# EAGLE design Tact_Switch (EAGLE 7.6.0)
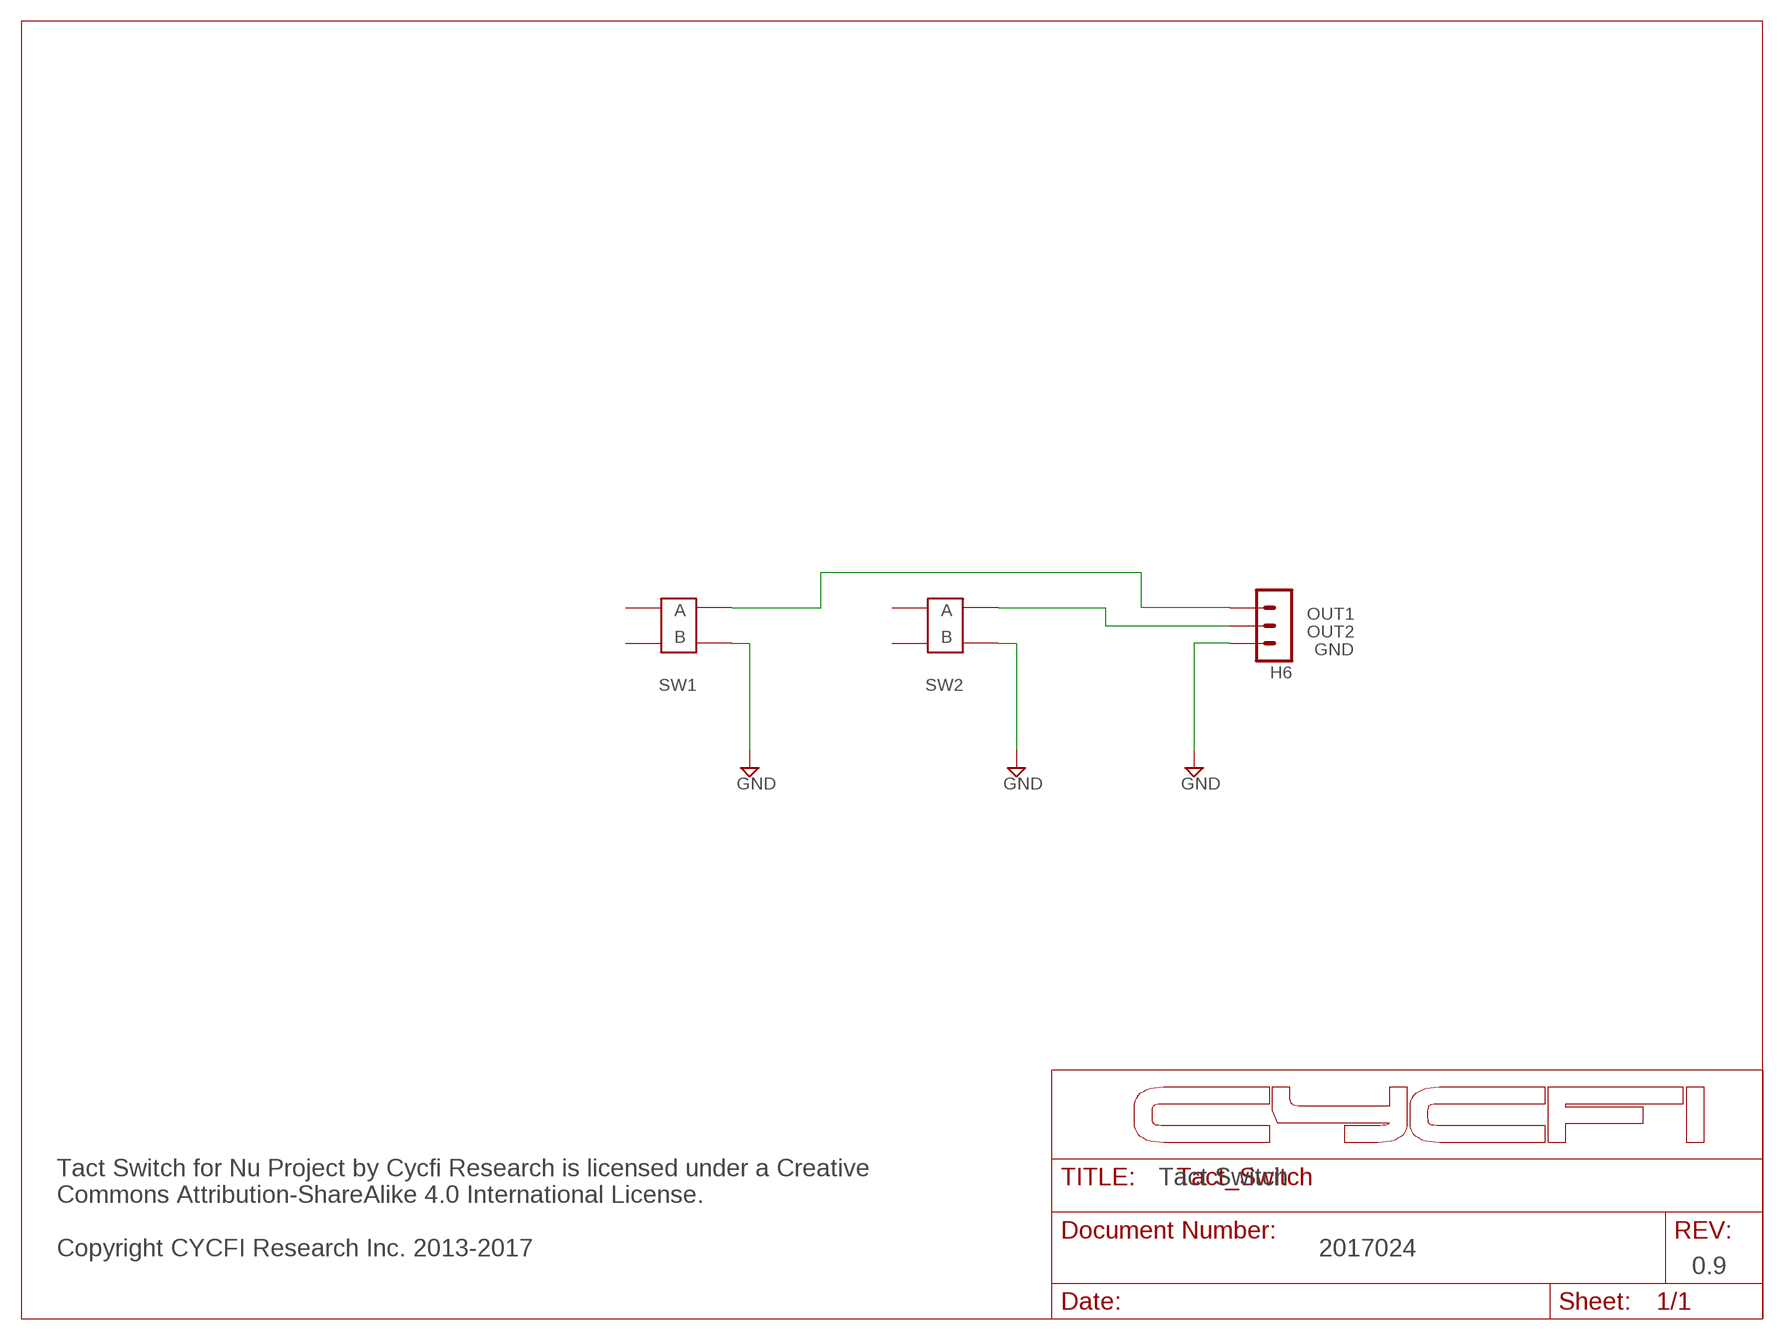
[diagram p0: schematic, sheet 1]

## Parts
H6  3PIN-SMD-2.54MM  [3P-SMD-2.54MM]
U$1  TACT_MJTP1230  [MJTP1230]
U$2  TACT_MJTP1230  [MJTP1230]

## Nets
GND: H6.P$3 U$1.2B U$2.2B
N$3: H6.P$1 U$1.1B
S1: H6.P$2 U$2.1B
Unconnected: U$1.1A U$1.2A U$2.1A U$2.2A

## Notes on the sheet
- OUT1
- OUT2
- GND
- SW1 | SW2
- Tact Switch
- Tact Switch for Nu Project by Cycfi Research is licensed under a Creative 
  Commons Attribution-ShareAlike 4.0 International License.
  
  Copyright CYCFI Research Inc. 2013-2017
- 2017024
- 0.9

## Library data of the parts
H6 = CYCFI_Con:3PIN-SMD-2.54MM
U$1 U$2 = CYCFI_switch:TACT_MJTP1230

## Board
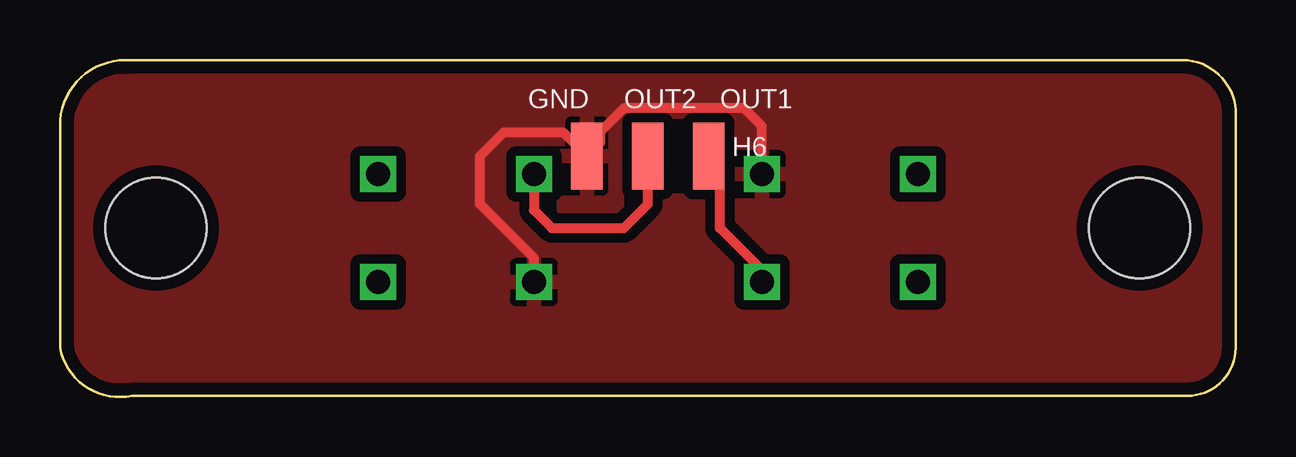
[diagram p1: board, top side]
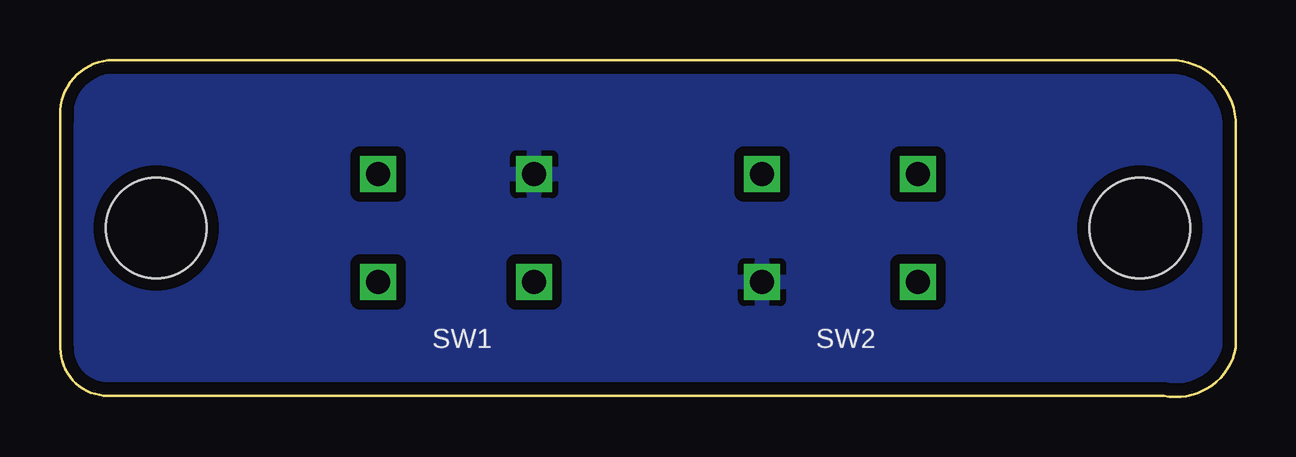
[diagram p2: board, bottom side, seen from below]

Size 49.01 x 14.06 mm. Coordinates in mm from the lower left corner, seen from the top.
Outline: 3,0.05 47,0.05 arc90 49,2.05 49,11.55 arc90 47,14.05 3,14.05 arc90 0,11.55 0,2.05 arc90 3,0.05
Copper layers (1*16): Top 0.035mm / dielectric 1.6mm / Bottom 0.035mm
Design rules "Elecrow_2-layer_PCB_eagle_rule": minimum track width 6mil, minimum drill 12mil, track to track 6mil, track to pad 8mil, pad to pad 12mil, via to via 12mil, smd to smd 0mil, copper to edge 20mil, drill to drill 10mil, minimum pad ring 6mil, minimum via ring 6mil, stop-mask expansion 0mil, vias tented up to drill 100mil, thermal gap 10mil
Holes 4.2 mm at 4,7.05 45,7.05

### Footprints (pad centres in the part's own frame; a part is rotated, then mirrored left to right if it is on the bottom)
3P-SMD-2.54MM = smd 1.3 x 2.8: P$1 -2.54,0; P$2 0,0; P$3 2.54,0
MJTP1230 = drill 1 square: 1A -3.25,2.25; 1B 3.25,2.25; 2A -3.25,-2.25; 2B 3.25,-2.25

### Placement (x,y rotation side)
H6  24.5,10.05 180 top
U$1  32.5,7.05 180 top
U$2  16.5,7.05 0 top

### Tracks (layer width: path | path; a pad name or v marks a point on that pad's centre or on a via)
GND
  Top 0.406: U$1.2B 29.25,11.3 28.5,12.05 23.5,12.05 22.5,11.05 22.5,10.59 H6.P$3 20.96,11.05 18.5,11.05 17.5,10.05 17.5,8.05 19.75,5.8 U$2.2B
  pour Top (isolate 0.406): 49,11.55 49,2.55 arc-90 47,0.55 3,0.55 arc-90 0,2.55 0,11.55 arc-90 3,14.05 47,14.05 arc-90
  pour Bottom (isolate 0.406): 49,11.55 49,2.55 arc-90 47,0.55 3,0.55 arc-90 0,2.55 0,11.55 arc-90 3,14.05 47,14.05 arc-90
N$3
  Top 0.406: U$1.1B 29.25,5.3 27.5,7.05 27.5,9.59 H6.P$1
S1
  Top 0.406: U$2.1B 19.75,7.8 20.5,7.05 23.5,7.05 24.5,8.05 H6.P$2

### Text on the board
tNames: GND | OUT2 | OUT1 | H6
bNames: SW2 | SW1